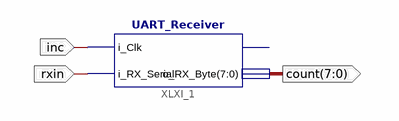
[diagram p0: schematic sheet 1]
// Xilinx ISE schematic rx.sch (spartan6) as structural Verilog: 1 symbols, 3 ports
module rx (
  input  inc,
  input  rxin,
  output [7:0] count
);

  UART_Receiver XLXI_1 (.i_Clk(inc), .i_RX_Serial(rxin), .o_RX_Byte(count));  // open: o_RX_DV
endmodule
